# EasyEDA Pro project P4VGA565.eprj

# Schematic Schematic1
Board Name: Board1; Create Date: 2025-11-13; Page Name: P1_1; Project Name: P4VGA565; Schematic Name: Schematic1; Update Date: 2025-11-14; Company: EasyEDA.com; Page Size: A4; Version: V1.0
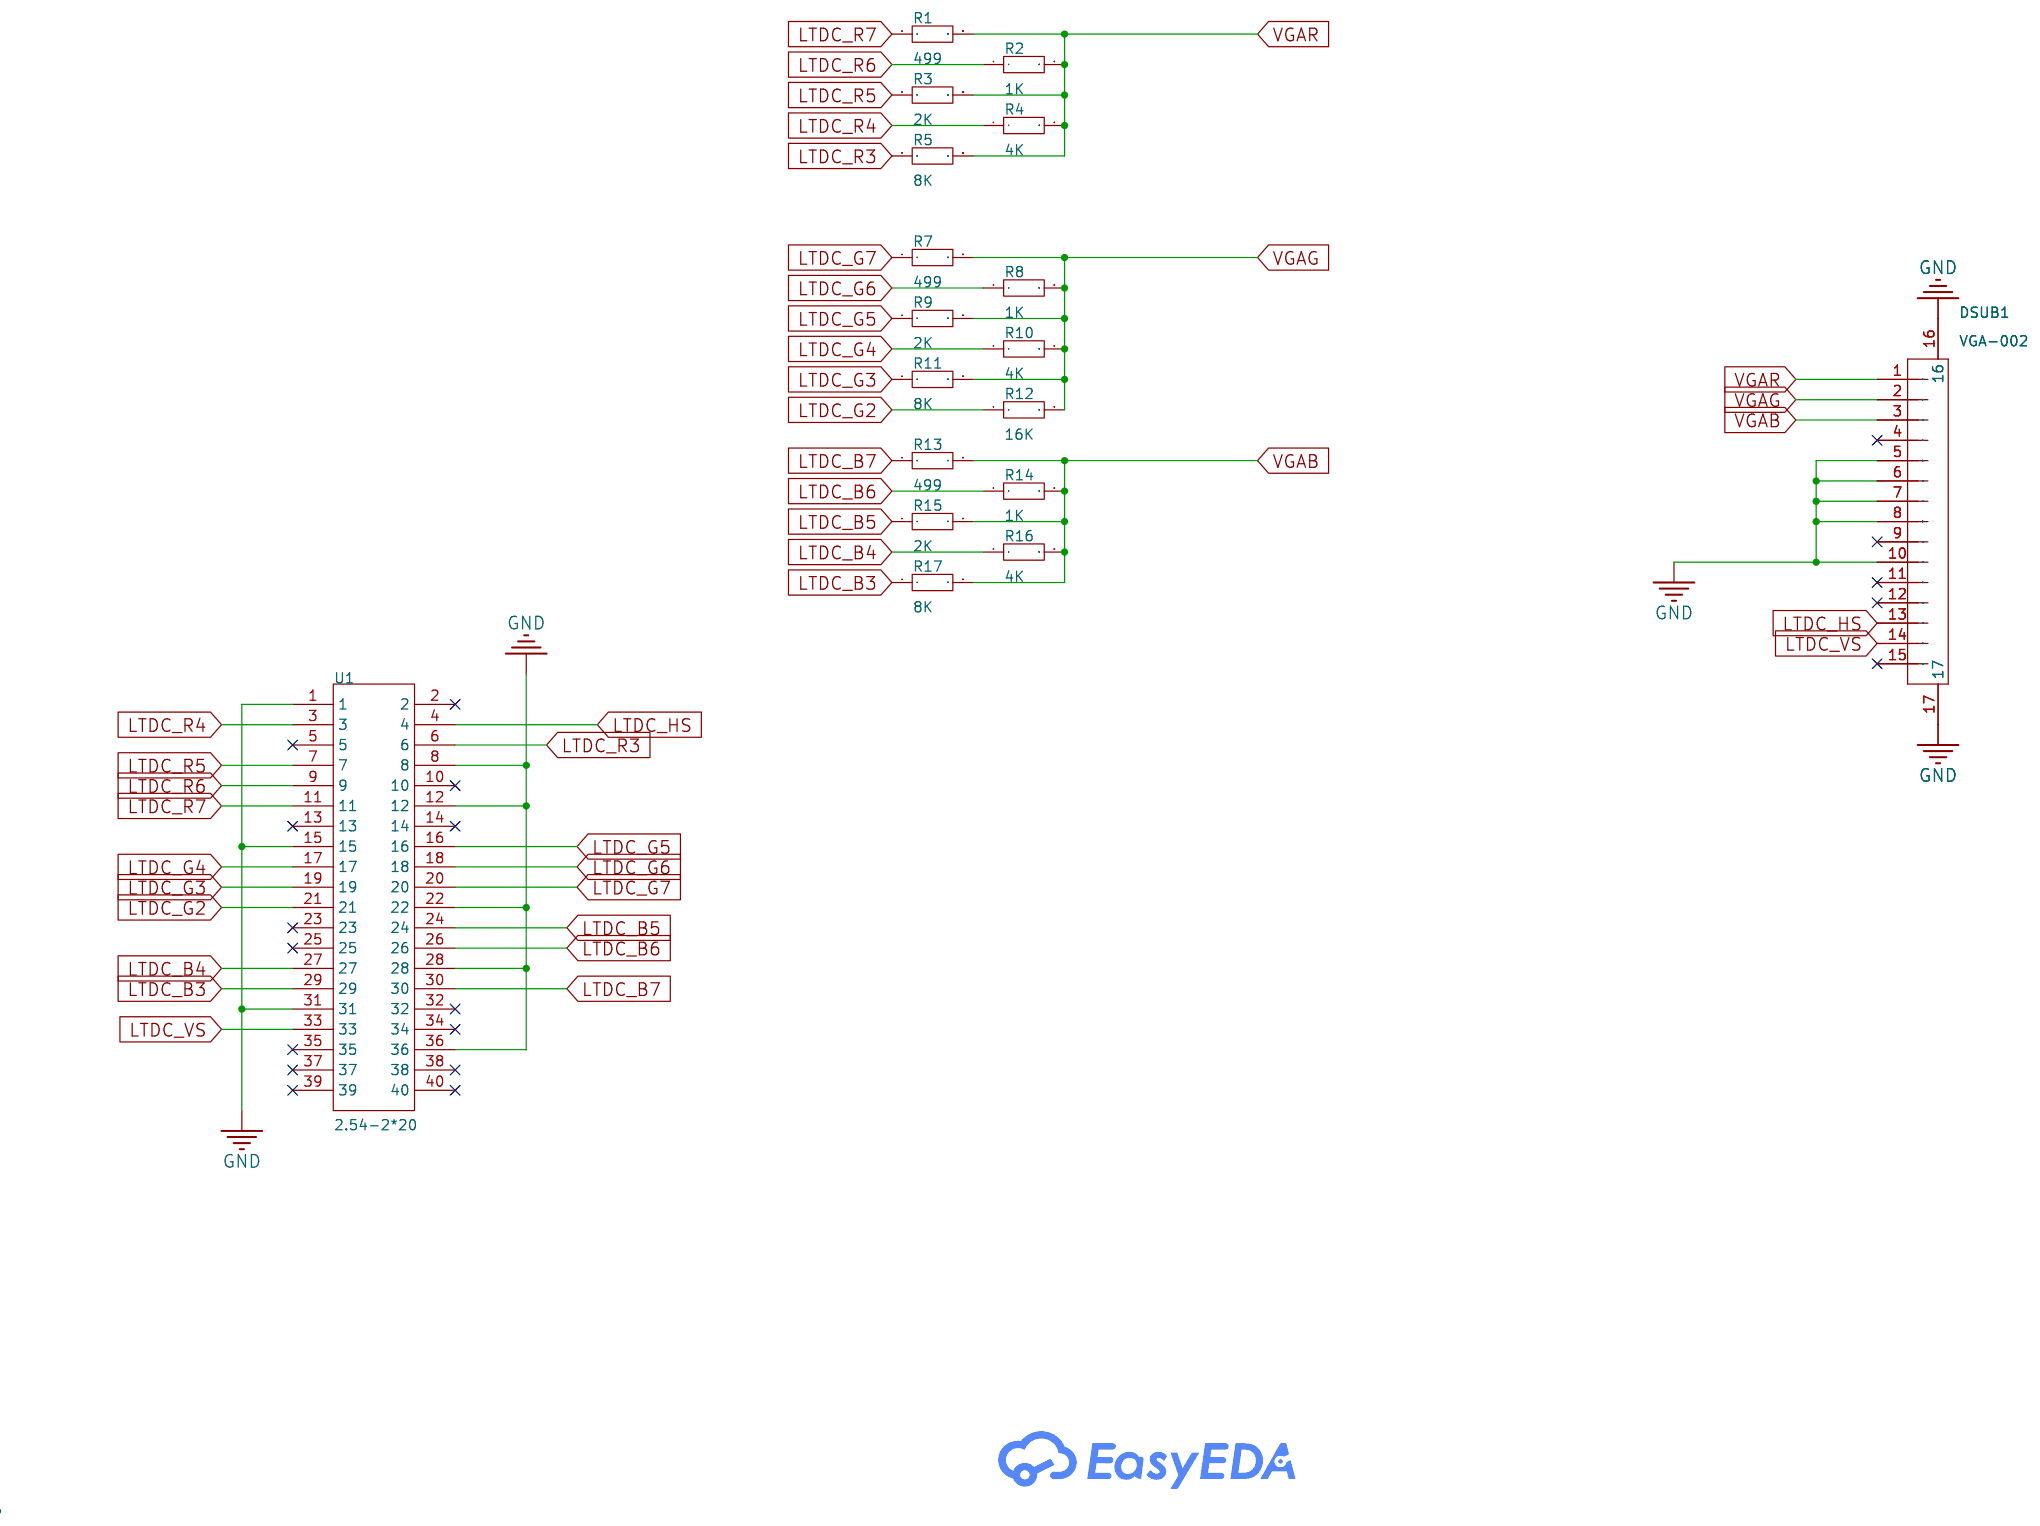
[diagram p0: schematic sheet]

## Parts
DSUB1  VGA-002  [D-SUB-TH_VGA-002]
R1  499  [R0603]
R2  1K  [R0603]
R3  2K  [R0603]
R4  4K  [R0603]
R5  8K  [R0603]
R7  499  [R0603]
R8  1K  [R0603]
R9  2K  [R0603]
R10  4K  [R0603]
R11  8K  [R0603]
R12  16K  [R0603]
R13  499  [R0603]
R14  1K  [R0603]
R15  2K  [R0603]
R16  4K  [R0603]
R17  8K  [R0603]
U1  2.54-2*20  [HDR-TH_40P-P2.54-V-F-R2-C20-S2.54]

## Library data of the parts
DSUB1 = VGA-002: Connector Type:High Density D-Sub Gender:Female Number of Pins:15P Mounting Type:Right Angle Number of Rows:3 Current Rating-Signal:500mA Current Rating-Power:- Voltage Rating:30V Color:Blue Operating Temperature:- Operating Temperature:-; LCSC Part Name: D-Sub 母 P数:15P; Supplier Part: C138387; Manufacturer: BOOMELE(博穆精密); Supplier Footprint: 弯插; JLCPCB Part Class: Extended Part; Datasheet: https://item.szlcsc.com/datasheet/VGA-002/149705.html; Supplier: LCSC; Connector Type: High Density D-Sub; Gender: Female; Number of Pins: 15P; Mounting Type: Right Angle; Number of Rows: 3; Current Rating-Signal: 500mA; Voltage Rating: 30V; Color: Blue
R1-R5 R7-R17 = Res_0603: Supplier Footprint: 0603
U1 = 2.54-2*20: LCSC Part Name: 间距:2.54mm 2x20P 直插; Supplier Part: C2977589; Manufacturer: ZHOURI(洲日); Supplier Footprint: 插件,P=2.54mm; JLCPCB Part Class: Extended Part; Datasheet: https://item.szlcsc.com/datasheet/2.54-2*20/3388941.html; Supplier: LCSC; Holes Structure: 2x20P; Pitch: 2.54mm; Row Spacing: 2.54mm; Circular Hole / Square Hole: Square Hole; Mounting Type: Through Hole; Number of Rows: 2; Number of Positions: 40P; Current Rating: 2.5A; Holes Direction: Top; Insulation Height: 8.5mm; Operating Temperature: -40℃~+105℃

## Nets
GND: DSUB1.5 DSUB1.6 DSUB1.7 DSUB1.8 DSUB1.10 DSUB1.16 DSUB1.17 U1.1 U1.8 U1.12 U1.15 U1.22 U1.28 U1.31 U1.36
LTDC_B3: R17.1 U1.29
LTDC_B4: R16.1 U1.27
LTDC_B5: R15.1 U1.24
LTDC_B6: R14.1 U1.26
LTDC_B7: R13.1 U1.30
LTDC_G2: R12.1 U1.21
LTDC_G3: R11.1 U1.19
LTDC_G4: R10.1 U1.17
LTDC_G5: R9.1 U1.16
LTDC_G6: R8.1 U1.18
LTDC_G7: R7.1 U1.20
LTDC_HS: DSUB1.13 U1.4
LTDC_R3: R5.1 U1.6
LTDC_R4: R4.1 U1.3
LTDC_R5: R3.1 U1.7
LTDC_R6: R2.1 U1.9
LTDC_R7: R1.1 U1.11
LTDC_VS: DSUB1.14 U1.33
VGAB: DSUB1.3 R13.2 R14.2 R15.2 R16.2 R17.2
VGAG: DSUB1.2 R7.2 R8.2 R9.2 R10.2 R11.2 R12.2
VGAR: DSUB1.1 R1.2 R2.2 R3.2 R4.2 R5.2

Not connected (* = marked no-connect by the designer): DSUB1 4* 9* 11* 12* 15*; U1 2* 5* 10* 13* 14* 23* 25* 32* 34* 35* 37* 38* 39* 40*

# Board PCB1
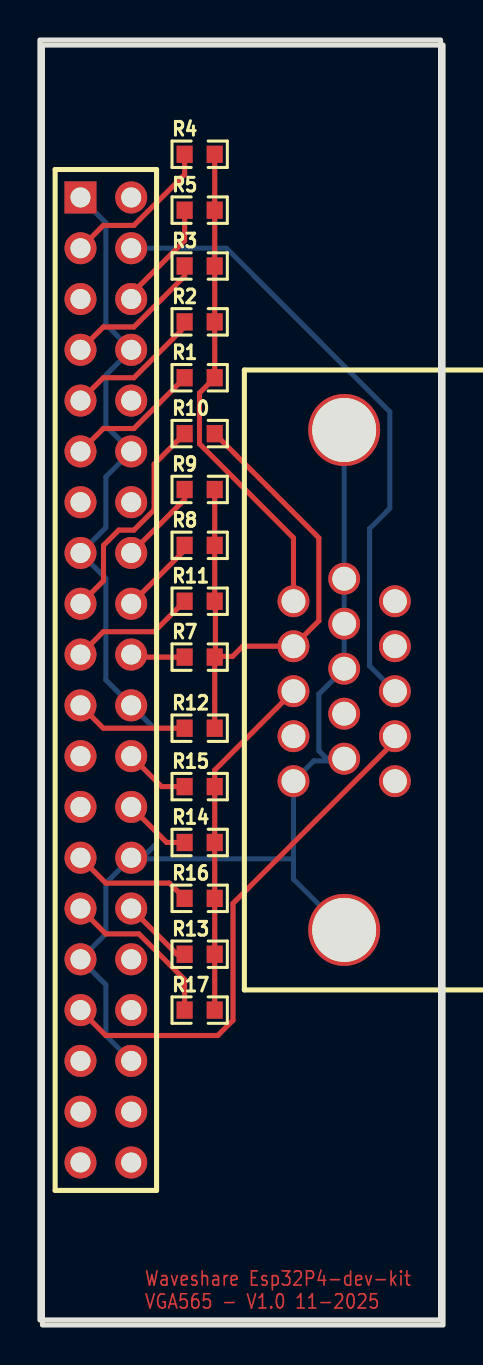
[diagram p1: board, top side]
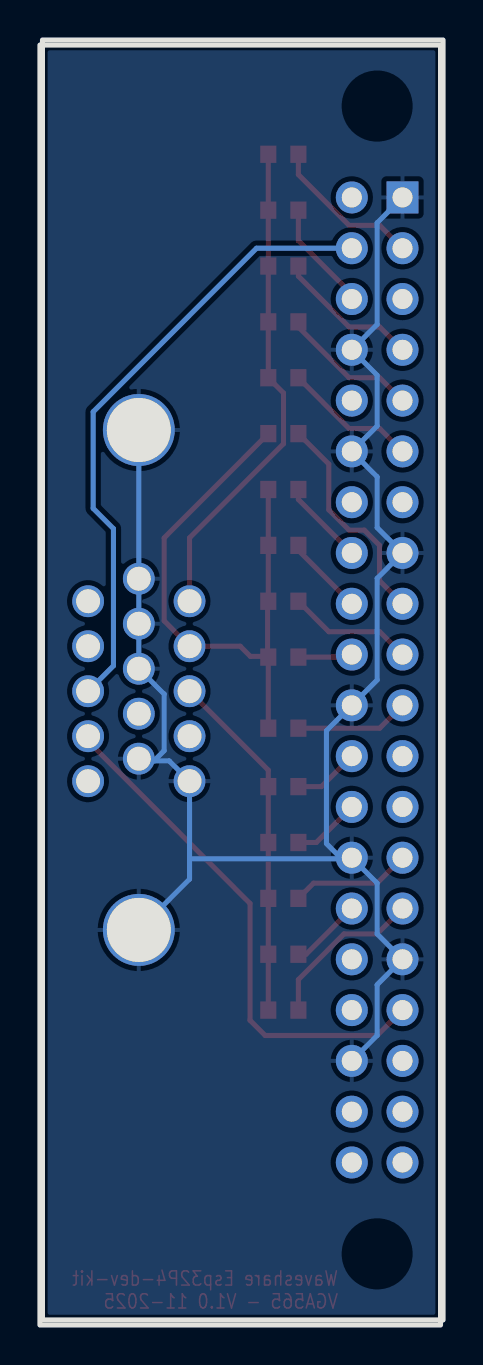
[diagram p2: board, bottom side, seen from below]

Outline 20.19 x 64.26 mm; copper layers: Top Layer, Bottom Layer. Coordinates in mm from the lower left corner of the outline.
Outline path: rectangle 0,64.26 20.07,0.25 ; rectangle 0.13,64.01 20.19,0
Stack: Top Layer 0.035mm / Dielectric1 1.51mm FR4 er 4.5 / Bottom Layer 0.035mm

## Design rules (mm)
template: JLCPCB Capability(Two Layers Board)
spacing copperThickness1oz (default): track to track 0.102, other pairs 0.152 to 0.3
spacing copperThickness2oz: track to track 0.203, other pairs 0.152 to 0.3
track width copperThickness1oz (default): min 0.127, default 0.254, max 2.54
track width copperThickness2oz: min 0.203, default 0.254, max 2.54
differential pair differentialPair (default): width min 0.127, default 0.254, max 2.54; gap min 0.152, default 0.152
via viaSize (default): diameter min 0.5, default 0.61, max 10; hole min 0.3, default 0.305, max 6.3

## Placement (name value [footprint] x y rotation side)
DSUB1  VGA-002  [D-SUB-TH_VGA-002]  15.24 32.26 90 top
R1  499  [R0603]  8 47.37 0 top
R2  1K  [R0603]  8 50.17 0 top
R3  2K  [R0603]  8 52.96 0 top
R4  4K  [R0603]  8 58.55 0 top
R5  8K  [R0603]  8 55.75 0 top
R7  499  [R0603]  8 33.4 0 top
R8  1K  [R0603]  8 38.99 0 top
R9  2K  [R0603]  8 41.78 0 top
R10  4K  [R0603]  8 44.58 0 top
R11  8K  [R0603]  8 36.2 0 top
R12  16K  [R0603]  8 29.85 0 top
R13  499  [R0603]  8 18.54 0 top
R14  1K  [R0603]  8 24.13 0 top
R15  2K  [R0603]  8 26.92 0 top
R16  4K  [R0603]  8 21.34 0 top
R17  8K  [R0603]  8 15.75 0 top
U1  2.54-2*20  [HDR-TH_40P-P2.54-V-F-R2-C20-S2.54]  3.3 32.26 270 top

## Footprints (pads in the part's own frame, mm; a bottom-side part is the same pattern mirrored in y, then rotated)
D-SUB-TH_VGA-002
  round 1.593 hole 1.194: 1(3.938,2.54) 2(1.688,2.54) 3(-0.562,2.54) 4(-2.812,2.54) 5(-5.062,2.54) 6(5.062,0) 7(2.812,0) 8(0.562,0) 9(-1.688,0) 10(-3.938,0) 11(3.938,-2.54) 12(1.688,-2.54) 13(-0.562,-2.54) 14(-2.812,-2.54) 15(-5.062,-2.54)
  round 3.599 hole 3.2: 16(12.5,0) 17(-12.5,0)
HDR-TH_40P-P2.54-V-F-R2-C20-S2.54
  rect 1.6x1.6 hole 1: 1(-24.13,-1.27)
  round 1.6 hole 1: 2(-24.13,1.27) 3(-21.59,-1.27) 4(-21.59,1.27) 5(-19.05,-1.27) 6(-19.05,1.27) 7(-16.51,-1.27) 8(-16.51,1.27) 9(-13.97,-1.27) 10(-13.97,1.27) 11(-11.43,-1.27) 12(-11.43,1.27) 13(-8.89,-1.27) 14(-8.89,1.27) 15(-6.35,-1.27) 16(-6.35,1.27) 17(-3.81,-1.27) 18(-3.81,1.27) 19(-1.27,-1.27) 20(-1.27,1.27) 21(1.27,-1.27) 22(1.27,1.27) 23(3.81,-1.27) 24(3.81,1.27) 25(6.35,-1.27) 26(6.35,1.27) 27(8.89,-1.27) 28(8.89,1.27) 29(11.43,-1.27) 30(11.43,1.27) 31(13.97,-1.27) 32(13.97,1.27) 33(16.51,-1.27) 34(16.51,1.27) 35(19.05,-1.27) 36(19.05,1.27) 37(21.59,-1.27) 38(21.59,1.27) 39(24.13,-1.27) 40(24.13,1.27)
R0603
  rect 0.806x0.864 smd: 1(-0.753,0) 2(0.753,0)

## Nets
As in the schematic.

Pads without a net: DSUB1 4 9 11 12 15; U1 2 5 10 13 14 23 25 32 34 35 37 38 39 40

## Routing (per net, layer and track width the routed paths; a pad name or vN(x,y) marks a point on that pad's centre or on a via; arc(x,y) is an arc through that point)
GND: length 87.3
  Bottom Layer w0.254: 4.57,13.21 3.3,14.48 3.3,17.02 U1.31 3.3,19.56 3.3,22.1 4.57,23.37 4.63,23.31 5.08,23.31 ; 5.08,23.31 5.84,24.08 5.84,29.72 3.3,32.26 3.3,37.34 U1.15 3.3,39.88 3.3,42.42 4.57,43.69 3.3,44.96 3.3,47.5 4.57,48.77 3.3,50.04 3.3,55.12 U1.1 ; 5.08,23.31 12.7,23.31 ; DSUB1.17 12.7,22.3 12.7,23.31 ; 14.48,28.21 13.72,28.21 DSUB1.5 12.7,23.31 ; 14.48,28.21 15.13,28.21 DSUB1.10 ; 14.48,28.21 13.97,28.72 13.97,31.55 DSUB1.8 DSUB1.7 DSUB1.6 DSUB1.16
LTDC_B3: length 8.2
  Top Layer w0.254: R17.1 7.25,17.27 4.96,19.56 3.3,19.56 U1.29
LTDC_B4: length 6.1
  Top Layer w0.254: R16.1 6.49,22.1 3.3,22.1 U1.27
LTDC_B5: length 3.3
  Top Layer w0.254: R15.1 6.1,26.92 4.57,28.45
LTDC_B6: length 3.4
  Top Layer w0.254: 4.57,25.91 6.35,24.13 R14.1
LTDC_B7: length 3.6
  Top Layer w0.254: 4.57,20.83 6.86,18.54 R13.1
LTDC_G2: length 5.7
  Top Layer w0.254: R12.1 3.18,29.85 U1.21
LTDC_G3: length 6.3
  Top Layer w0.254: U1.19 3.18,34.67 5.72,34.67 R11.1
LTDC_G4: length 11.1
  Top Layer w0.254: U1.17 3.18,37.22 3.18,38.99 3.95,39.75 4.71,39.75 5.72,40.77 5.72,43.05 R10.1
LTDC_G5: length 4.3
  Top Layer w0.254: 4.57,38.61 7.25,41.28 R9.1
LTDC_G6: length 4
  Top Layer w0.254: 4.57,36.07 7.25,38.74 R8.1
LTDC_G7: length 2.7
  Top Layer w0.254: 4.57,33.53 4.7,33.4 R7.1
LTDC_HS: length 31.3
  Bottom Layer w0.254: 4.57,53.85 9.34,53.85 17.53,45.67 17.53,40.84 16.51,39.82 16.51,32.97 DSUB1.13
LTDC_R3: length 5.6
  Top Layer w0.254: 4.57,51.31 4.57,51.55 7.25,54.23 R5.1
LTDC_R4: length 7.8
  Top Layer w0.254: U1.3 3.18,54.99 4.71,54.99 7.25,57.53 R4.1
LTDC_R5: length 7.2
  Top Layer w0.254: U1.7 3.18,49.91 4.71,49.91 7.25,52.45 R3.1
LTDC_R6: length 7
  Top Layer w0.254: U1.9 3.18,47.37 4.71,47.37 7.25,49.91 R2.1
LTDC_R7: length 6.7
  Top Layer w0.254: R1.1 4.71,44.83 3.18,44.83 U1.11
LTDC_VS: length 26
  Top Layer w0.254: U1.33 3.3,14.48 8.91,14.48 9.67,15.24 9.67,21.08 17.78,29.19 DSUB1.14
VGAB: length 17.6
  Top Layer w0.254: R17.2 R13.2 R16.2 R14.2 R15.2 8.75,27.75 DSUB1.3
VGAG: length 29.4
  Top Layer w0.254: 8.79,33.44 9.65,33.44 10.16,33.95 DSUB1.2 13.97,35.22 13.97,39.36 R10.2 ; 8.79,33.44 R7.2 R12.2 ; 8.79,33.44 8.79,36.16 R11.2 R8.2 R9.2
VGAR: length 24.6
  Top Layer w0.254: R4.2 R5.2 R3.2 R2.2 R1.2 7.99,46.61 7.99,44.07 12.7,39.36 DSUB1.1

## Copper pours and planes (outline as drawn; the poured copper is in the pictures)
GND on Bottom Layer: 0,64.26 20.07,64.26 20.07,0.25 0,0.25

## Text on the board
Top Layer: Waveshare Esp32P4-dev-kit / VGA565 - V1.0 11-2025
